# EAGLE design DC_DC_Converter_rev1 (EAGLE 9.6.2)
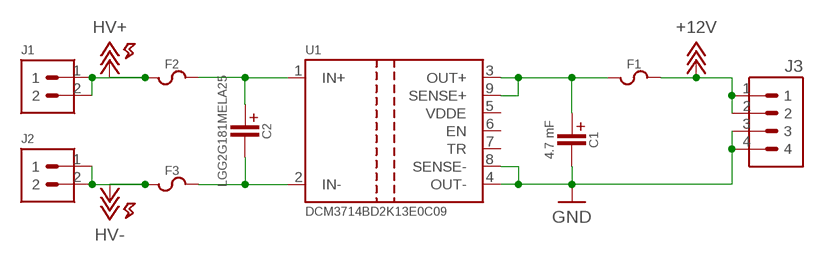
[diagram p0: schematic, sheet 1]

## Parts
C1  4.7 mF  EKYC250E__622MM25S  [EKYC*MM]
C2  LGG2G181MELA25  [L*A]
F1  FUSE_MINIBLADE  [MINI-BLADE_FUSE_HOLDER]
F2  885_FUSE  [0885]
F3  885_FUSE  [0885]
J1  CONNECTOR-2  [MOLEX_NANOFIT_PTH_02]
J2  CONNECTOR-2  [MOLEX_NANOFIT_PTH_02]
J3  CONNECTOR-4MINIFIT  [MOLEX_MINIFIT_PTH_04]
U1  DCM3714BD2K13E0C09  [3714DCM_VIA]

## Nets
12V_UNFUSED: C1.+(PLUS) F1.L1 F1.L2 U1.3(OUT+) U1.9(SENSE+)
+12V: F1.R1 F1.R2 J3.1 J3.2
GND: C1.-(MINUS) J3.3 J3.4 U1.4(OUT-) U1.8(SENSE-)
HV+: F2.1 J1.1 J1.2
HV-: F3.1 J2.1 J2.2
IN+: C2.+(PLUS) F2.2 U1.1(IN+)
IN-: C2.-(MINUS) F3.2 U1.2(IN-)
Unconnected: U1.6(EN) U1.7(TR)

## Power pins joined to a net without a drawn wire
VDDE: U1.5(VDDE)

## Library data of the parts
C1 = HyTechDevices:EKYC250E__622MM25S
C2 = HyTechDevices:LGG2G181MELA25
F1 = HyTechDevices:FUSE: Fuse/Fuseclips Keystone Electronics 3568 Fuse Mouser Part <http://www.mouser.com/ProductDetail/Keystone-Electronics/3568> Datasheet <http://www.mouser.com/ds/2/215/568-742601.pdf> Bussman/Eaton Midget Fuse Clip 1A3400 <http://www.mouser.com/ProductDetail/Bussmann-Eaton/BK-1A3400-09-R/?qs=sGAEpiMZZMuG%252bgnN5hGYGzzlAelq2OxnKqVSMVjq8I4%3d> Schurter 0751.0110 Brass Fuse Clip Datasheet <http://www.mouser.com/ds/2/358/typ_OG__Clip__5x20-2553.pdf> Bel Fuse 0ZCF Series Surface Mount PTC (resettable) Fuse Datasheet <https://belfuse.com/resources/CircuitProtection/datasheets/0ZCF%20Nov2016.pdf> Littelfuse 1812L Series Surface Mount PTC (resettable) Fuse Datasheet <https://m.littelfuse.com/~/media/electronics/datasheets/resettable_ptcs/littelfuse_ptc_1812l_datasheet.pdf.pdf>
F2 F3 = HyTechDevices:885_FUSE
J1 J2 = HyTechDevices:CONNECTOR-2: 2 Pin Connector; MPN: 1053091202
J3 = HyTechDevices:CONNECTOR-4: 4 Pin Connector
U1 = HyTechDevices:DCM3714BD2K13E0C09

## Board
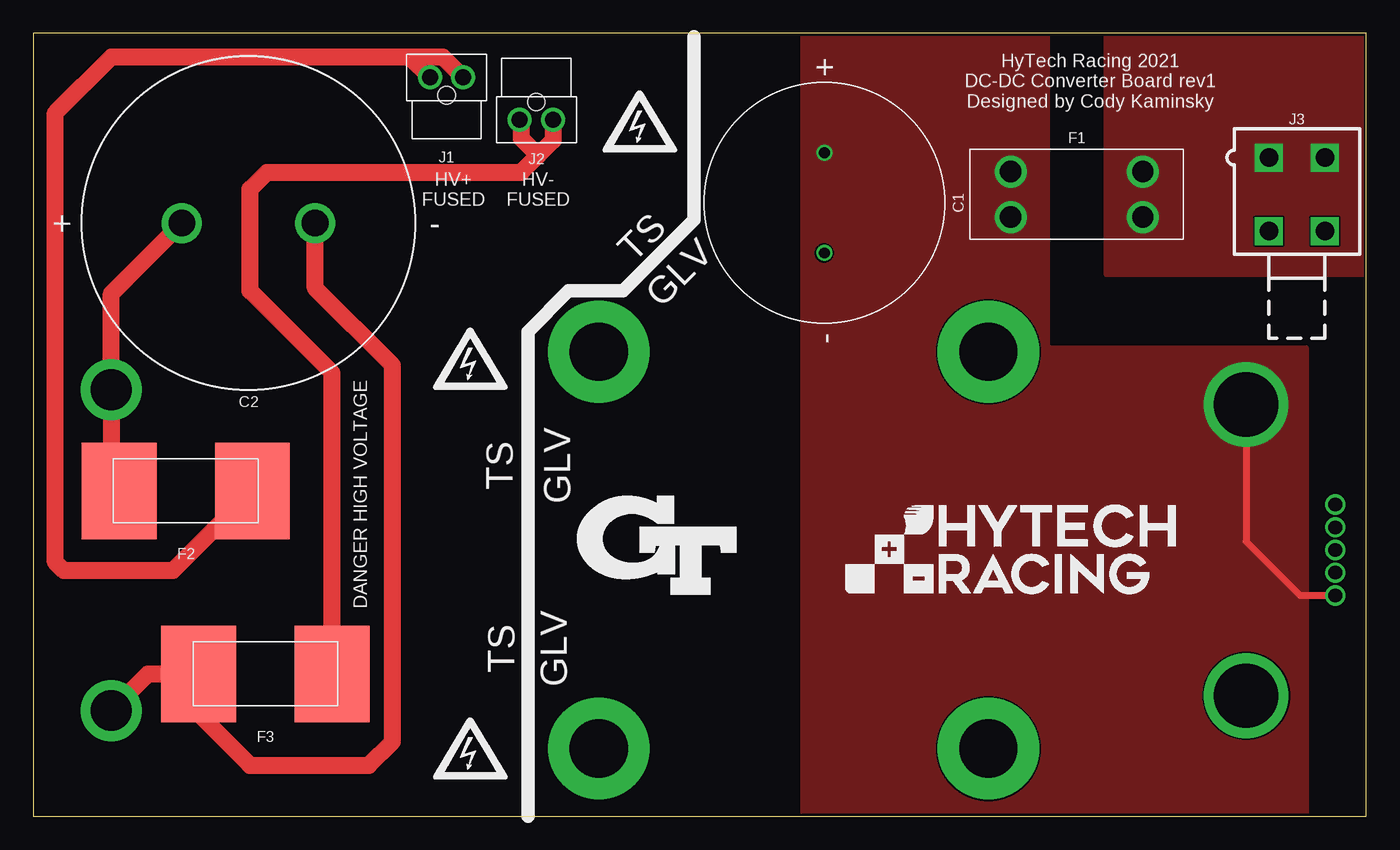
[diagram p1: board, top side]
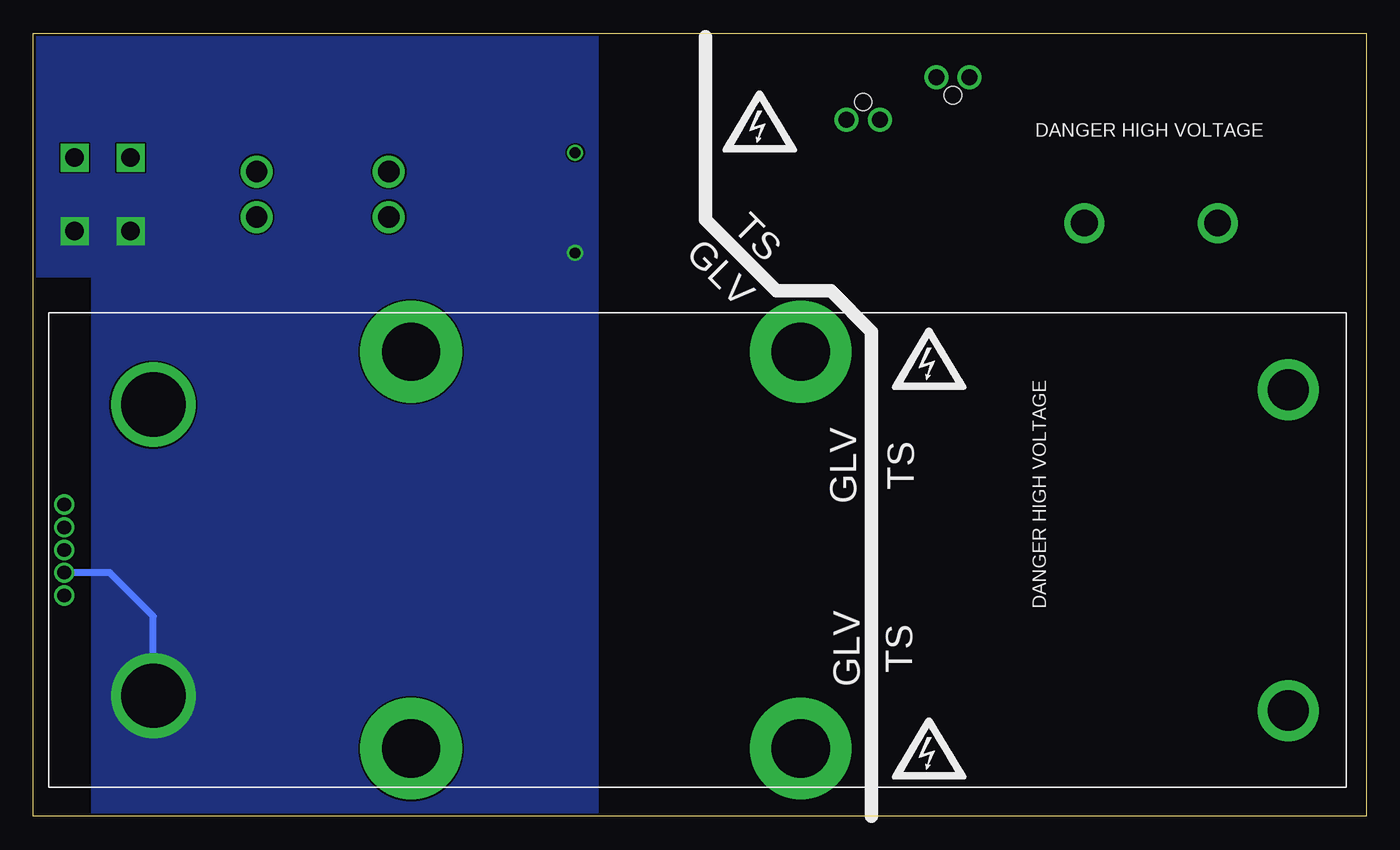
[diagram p2: board, bottom side, seen from below]

Size 99.93 x 58.67 mm. Coordinates in mm from the lower left corner, seen from the top.
Outline: 0,0 99.93,0 99.93,58.67 0,58.67 0,0
Copper layers (1*16): Top 0.035mm / dielectric 1.53mm / Bottom 0.035mm
Design rules "JLCPCB (2 Layer)": minimum track width 5mil, minimum drill 0.3mm, track to track 5mil, track to pad 5mil, pad to pad 5mil, via to via 20mil, smd to smd 5mil, copper to edge 0.2mm, drill to drill 21mil, minimum pad ring 6mil, minimum via ring 6mil, stop-mask expansion 6mil, vias tented up to drill 30mil, thermal gap 10mil

### Footprints (pad centres in the part's own frame; a part is rotated, then mirrored left to right if it is on the bottom)
EKYC*MM = drill 0.8: + 3.75,0; - -3.75,0
L*A = drill 2: + 5,0; - -5,0
MINI-BLADE_FUSE_HOLDER = drill 1.6: L1 -4.953,1.702; L2 -4.953,-1.702; R1 4.953,1.702; R2 4.953,-1.702
0885 = smd 5.6 x 7.23: 1 -5,0; 2 5,0
MOLEX_NANOFIT_PTH_02 = drill 1.2: 1 1.25,0; 2 -1.25,0 | hole 1.3: 0,1.34
MOLEX_MINIFIT_PTH_04 = drill 1.4 square: 1 2.1,-2.75; 2 -2.1,-2.75; 3 2.1,2.75; 4 -2.1,2.75
3714DCM_VIA = drill 3.048 pad 4.572: 1 0,-12.027; 2 0,12.027 | drill 4.826 pad 6.35: 3 85.09,-10.909; 4 85.09,10.909 | drill 1.016 pad 1.422: 5 91.77,-3.416; 6 91.77,-1.714; 7 91.77,-0.013; 8 91.77,1.689; 9 91.77,3.391 | drill 4.369 pad 7.62: 10 36.551,-14.872; 11 36.551,14.872; 12 65.761,-14.872; 13 65.761,14.872

### Placement (x,y rotation side)
C1  59.31,45.97 90 top
C2  16.13,44.45 180 top
F1  78.23,46.61 0 top
F2  11.43,24.38 180 top
F3  17.4,10.67 180 top
J1  30.99,55.37 180 top
J2  37.72,52.2 0 top
J3  94.74,46.61 180 top
U1  5.84,19.94 180 bottom
U$1  [HV_0.50"]  32.77,5.08 0 top
U$2  [HV_0.50"]  32.77,34.29 0 top
U$3  [HV_0.50"]  45.47,52.07 0 top
U$6  [LOGO_HYTECH_1.0"]  60.58,16.38 0 top
U$7  [LOGO_GT_0.50"]  46.74,20.32 0 top
U$8  [HV_0.50"]  32.77,5.08 0 bottom
U$9  [HV_0.50"]  32.77,34.29 0 bottom
U$10  [HV_0.50"]  45.47,52.07 0 bottom

### Tracks (layer width: path | path; a pad name or v marks a point on that pad's centre or on a via)
12V_UNFUSED
  Top 0.508: U1.3 90.93,20.57 94.96,16.55 U1.9
  pour Top (no thermals): 57.79,59.18 75.95,59.18 75.95,35.05 95.38,35.05 95.38,-0.13 57.79,-0.13
+12V
  pour Top (no thermals): 80.52,59.18 100.84,59.18 100.84,40.64 80.52,40.64
GND
  Bottom 0.508: U1.4 90.93,14.99 94.2,18.25 U1.8
  pour Bottom (no thermals): 57.79,59.05 100.84,59.05 100.84,40.64 95.38,40.64 95.38,-0.13 57.79,-0.13
HV+
  Top 1.27: F2.1 10.46,18.41 2.29,18.41 1.65,19.05 1.65,52.7 5.84,56.9 28.21,56.9 | J1.1 28.21,56.9 | J1.2 30.71,56.9 28.21,56.9
HV-
  Top 1.27: F3.1 22.4,33.23 16.26,39.37 16.26,46.99 17.53,48.26 36.58,48.26 37.85,49.53 | J2.2 36.58,52.09 36.58,50.8 37.85,49.53 | J2.1 38.97,50.65 37.85,49.53
IN+
  Top 1.27: F2.2 6.35,24.38 5.84,23.88 U1.1 5.84,39.16 C2.+
IN-
  Top 1.27: U1.2 8.6,10.67 F3.2 12.4,7.67 16.26,3.81 25.15,3.81 26.92,5.59 26.92,33.78 21.13,39.58 C2.-

### Text on the board
tPlace: HyTech Racing 2021 / DC-DC Converter Board rev1 / Designed by Cody Kaminsky | HV+ / FUSED | HV- / FUSED | TS | GLV | TS | GLV | DANGER HIGH VOLTAGE | TS | GLV
bPlace: DANGER HIGH VOLTAGE | TS | GLV | TS | GLV | DANGER HIGH VOLTAGE | TS | GLV